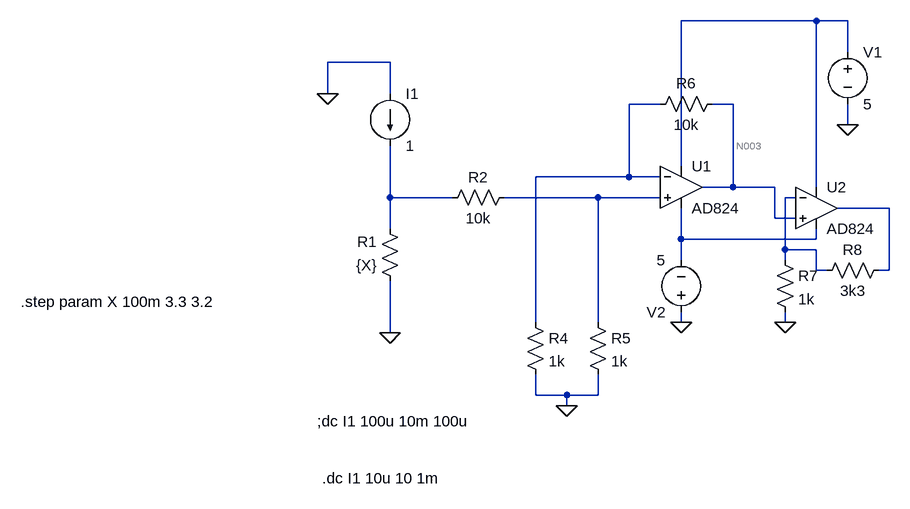
[diagram p0: schematic current-meas.asc]
current-meas.asc, the LTspice schematic file:
Version 4
SHEET 1 900 688
WIRE 784 -32 576 -32
WIRE 832 -32 784 -32
WIRE 832 16 832 -32
WIRE 128 32 32 32
WIRE 32 80 32 32
WIRE 128 80 128 32
WIRE 544 96 496 96
WIRE 656 96 624 96
WIRE 832 128 832 96
WIRE 576 192 576 -32
WIRE 496 208 496 96
WIRE 496 208 352 208
WIRE 544 208 496 208
WIRE 656 224 656 96
WIRE 656 224 608 224
WIRE 720 224 656 224
WIRE 784 224 784 -32
WIRE 128 240 128 160
WIRE 224 240 128 240
WIRE 448 240 304 240
WIRE 544 240 448 240
WIRE 752 240 736 240
WIRE 896 256 816 256
WIRE 720 272 720 224
WIRE 752 272 720 272
WIRE 128 288 128 240
WIRE 576 304 576 256
WIRE 784 304 784 288
WIRE 784 304 576 304
WIRE 736 320 736 240
WIRE 784 320 736 320
WIRE 576 336 576 304
WIRE 736 336 736 320
WIRE 784 352 784 320
WIRE 800 352 784 352
WIRE 896 352 896 256
WIRE 896 352 880 352
WIRE 352 432 352 208
WIRE 448 432 448 240
WIRE 576 432 576 416
WIRE 736 432 736 416
WIRE 128 448 128 368
WIRE 352 544 352 512
WIRE 400 544 352 544
WIRE 448 544 448 512
WIRE 448 544 400 544
WIRE 400 560 400 544
FLAG 576 432 0
FLAG 400 560 0
FLAG 32 80 0
FLAG 832 128 0
FLAG 128 448 0
FLAG 736 432 0
SYMBOL current 128 80 R0
WINDOW 123 0 0 Left 0
WINDOW 39 0 0 Left 0
SYMATTR InstName I1
SYMATTR Value 1
SYMBOL res 144 384 R180
WINDOW 0 36 76 Left 2
WINDOW 3 36 40 Left 2
SYMATTR InstName R1
SYMATTR Value {X}
SYMBOL res 208 256 R270
WINDOW 0 32 56 VTop 2
WINDOW 3 0 56 VBottom 2
SYMATTR InstName R2
SYMATTR Value 10k
SYMBOL res 336 416 R0
SYMATTR InstName R4
SYMATTR Value 1k
SYMBOL res 432 416 R0
SYMATTR InstName R5
SYMATTR Value 1k
SYMBOL res 640 80 R90
WINDOW 0 0 56 VBottom 2
WINDOW 3 32 56 VTop 2
SYMATTR InstName R6
SYMATTR Value 10k
SYMBOL Opamps\\AD824 576 160 R0
SYMATTR InstName U1
SYMBOL voltage 832 0 R0
WINDOW 123 0 0 Left 0
WINDOW 39 0 0 Left 0
SYMATTR InstName V1
SYMATTR Value 5
SYMBOL voltage 576 432 R180
WINDOW 123 0 0 Left 0
WINDOW 39 0 0 Left 0
SYMATTR InstName V2
SYMATTR Value 5
SYMBOL Opamps\\AD824 784 192 R0
SYMATTR InstName U2
SYMBOL res 720 320 R0
SYMATTR InstName R7
SYMATTR Value 1k
SYMBOL res 896 336 R90
WINDOW 0 0 56 VBottom 2
WINDOW 3 32 56 VTop 2
SYMATTR InstName R8
SYMATTR Value 3k3
SYMATTR SpiceLine tol=1
TEXT 16 584 Left 2 !;dc I1 100u 10m 100u
TEXT 24 672 Left 2 !.dc I1 10u 10 1m
TEXT -440 400 Left 2 !.step param X 100m 3.3 3.2

The netlist it stands for:
* current-meas.asc
I1 0 N004 1
R1 0 N004 {X}
R2 N004 N005 10k
R4 N002 0 1k
R5 N005 0 1k
R6 N003 N002 10k
XU1 N005 N002 N001 N008 N003 AD824  ; pins In+ In- V+ V- OUT
V1 N001 0 5
V2 0 N008 5
XU2 N003 N006 N001 N008 N007 AD824  ; pins In+ In- V+ V- OUT
R7 N006 0 1k
R8 N007 N006 3k3 tol=1
;dc I1 100u 10m 100u
.dc I1 10u 10 1m
.step param X 100m 3.3 3.2
.backanno
.end

* Results of the author's LTspice run, read from the files saved beside the schematic
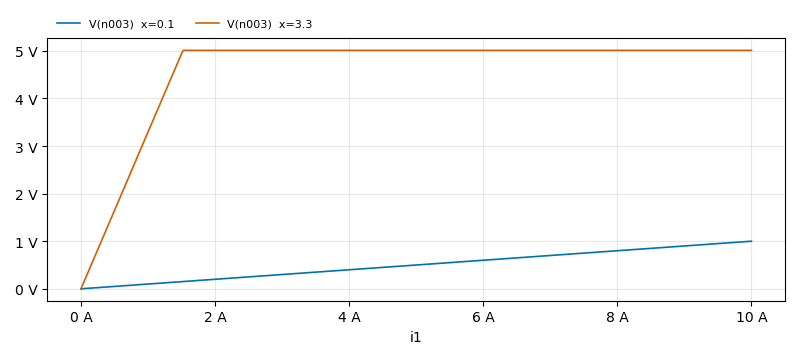
[diagram p1: DC transfer characteristic of current-meas.asc, plotted from the saved traces]
* DC transfer characteristic, 2 runs:
*   V(n003) [x=0.1]: 1 µV at i1=10 µA, 1 V at i1=10 A, min 1 µV, max 1 V
*   V(n003) [x=3.3]: 32.99 µV at i1=10 µA, 5.01 V at i1=10 A, min 32.99 µV, max 5.01 V